# Altium schematic sheet 23005_3.SchDoc: Classic Computer IO Platform
size A3; Date: 06/11/2018; CompanyName: Heber Ltd; Organization: Heber Limited; DocumentNumber: 56-23005; Revision: 3; SheetNumber: 3; SheetTotal: 6
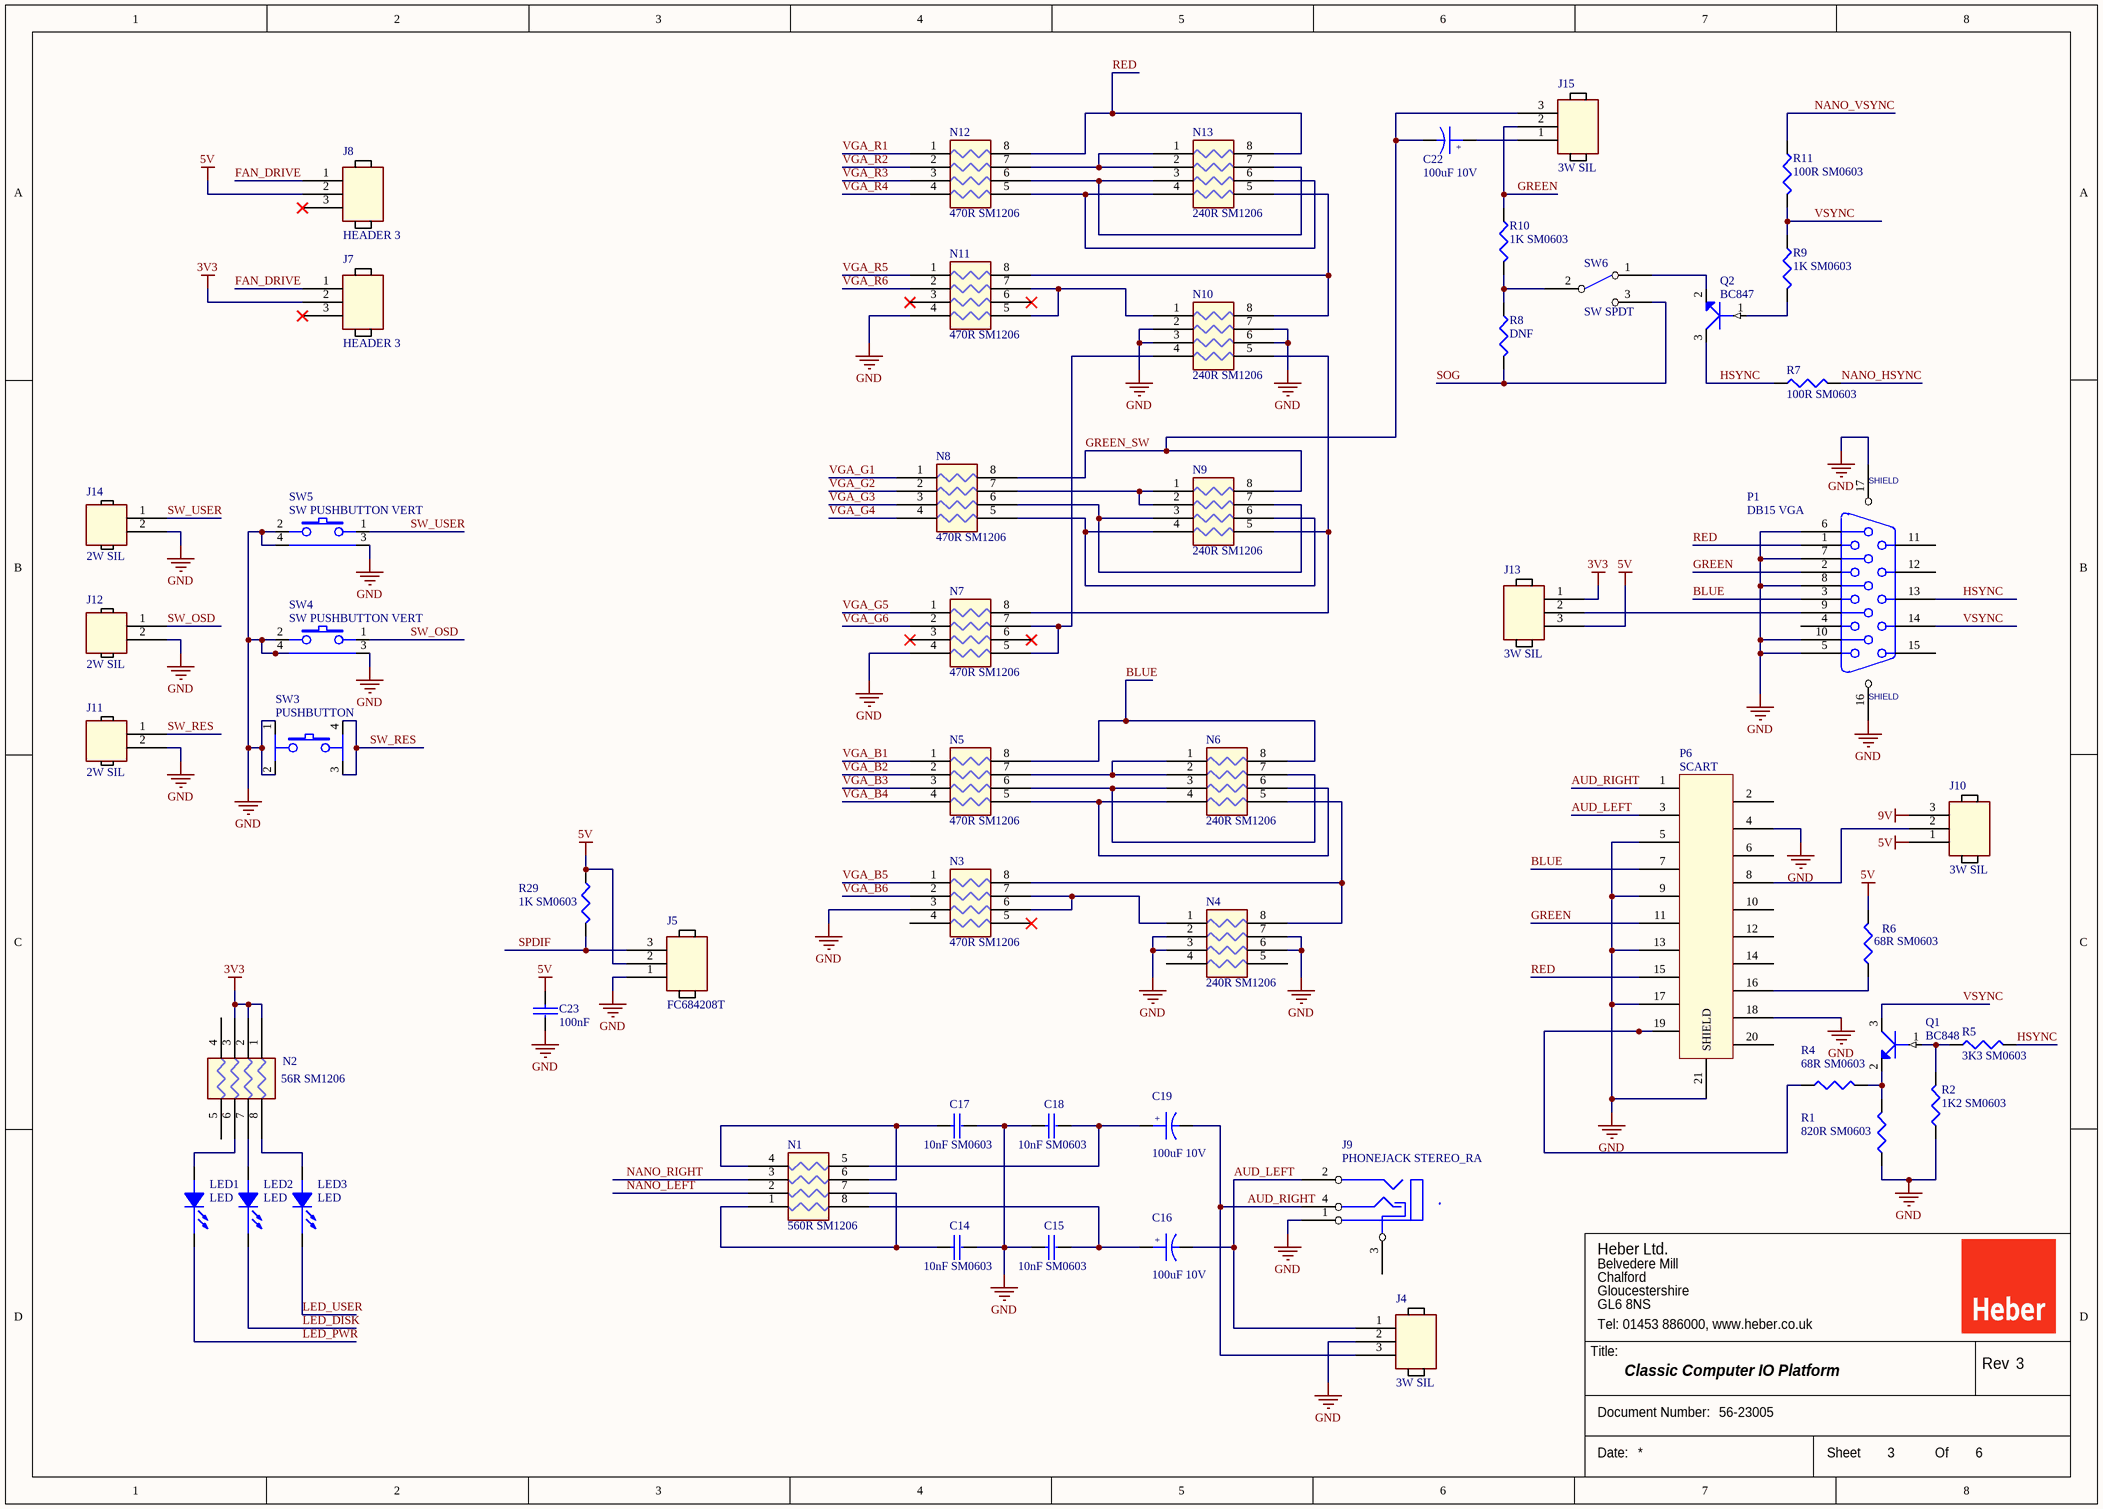
[diagram p0: 23005_3.SchDoc]

## Parts
C14  10nF SM0603  [SM0603]
C15  10nF SM0603  [SM0603]
C16  100uF 10V  [SM1206]
C17  10nF SM0603  [SM0603]
C18  10nF SM0603  [SM0603]
C19  100uF 10V  [SM1206]
C22  100uF 10V  [SM1206]
C23  100nF  [SM0603]
J4  3W SIL  [3WSIL]
J5  FC684208T  [FCR684208T]
J7  HEADER 3  [3W0.1KK]
J8  HEADER 3  [3W0.1KK]
J9  PHONEJACK STEREO_RA  [JACKSOCKET-STEREO]
J10  3W SIL  [3WSIL]
J11  2W SIL  [2WSIL]
J12  2W SIL  [2WSIL]
J13  3W SIL  [3WSIL]
J14  2W SIL  [2WSIL]
J15  3W SIL  [3WSIL]
LED1  LED  [SM0603LED_1]
LED2  LED  [SM0603LED_1]
LED3  LED  [SM0603LED_1]
N1  560R SM1206  [1206RES4_I2]
N2  56R SM1206  [1206RES4_I2]
N3  470R SM1206  [1206RES4_I2]
N4  240R SM1206  [1206RES4_I2]
N5  470R SM1206  [1206RES4_I2]
N6  240R SM1206  [1206RES4_I2]
N7  470R SM1206  [1206RES4_I2]
N8  470R SM1206  [1206RES4_I2]
N9  240R SM1206  [1206RES4_I2]
N10  240R SM1206  [1206RES4_I2]
N11  470R SM1206  [1206RES4_I2]
N12  470R SM1206  [1206RES4_I2]
N13  240R SM1206  [1206RES4_I2]
P1  DB15 VGA  [15WVGASKTRA]
P6  SCART  [K-SCART-024]
Q1  BC848  [SOT23]
Q2  BC847  [SOT23]
R1  820R SM0603  [SM0603]
R2  1K2 SM0603  [SM0603]
R4  68R SM0603  [SM0603]
R5  3K3 SM0603  [SM0603]
R6  68R SM0603  [SM0603]
R7  100R SM0603  [SM0603]
R8  DNF  [SM0603]
R9  1K SM0603  [SM0603]
R10  1K SM0603  [SM0603]
R11  100R SM0603  [SM0603]
R29  1K SM0603  [SM0603]
SW3  PUSHBUTTON  [SW_SM_6MM]
SW4  SW PUSHBUTTON VERT  [SW_TS6H2A]
SW5  SW PUSHBUTTON VERT  [SW_TS6H2A]
SW6  SW SPDT  [SW_ITT_OS102011MS2QN1]

## Nets
3V3: J7.2 J13.1 N2.1 N2.2 N2.3
5V: C23.1 J5.2 J8.2 J10.1 J13.3 R6.2 R29.1
9V: J10.3
GND: C14.2 C15.1 C17.2 C18.1 C23.2 J4.2 J5.1 J9.1 J11.2 J12.2 J14.2 N3.3 N4.2 N4.3 N4.6 N4.7 N7.4 N10.2 N10.3 N10.6 N10.7 N11.4 P1.5 P1.6 P1.7 P1.8 P1.10 P1.16 P1.17 P6.4 P6.5 P6.9 P6.13 P6.17 P6.18 P6.21(SHIELD) R1.2 R2.2 SW3.1 SW3.2 SW4.2 SW4.3 SW4.4 SW5.2 SW5.3 SW5.4
AUD_LEFT: C16.2 J4.1 J9.2 P6.3
AUD_RIGHT: C19.2 J4.3 J9.4 P6.1
BLUE: N5.8 N6.8 P1.3 P6.7
FAN_DRIVE: J7.1 J8.1
GREEN: J15.2 P1.2 P6.11 R10.1
GREEN_SW: C22.2 J15.3 N8.8 N9.8
HSYNC: P1.13 Q2.3(C) R5.1 R7.1
LED_DISK: LED2.2(CATHODE)
LED_PWR: LED1.2(CATHODE)
LED_USER: LED3.2(CATHODE)
NANO_HSYNC: R7.2
NANO_LEFT: N1.2
NANO_RIGHT: N1.3
NANO_VSYNC: R11.1
RED: N12.8 N13.8 P1.1 P6.15
SOG: R8.2 SW6.3(NO)
SPDIF: J5.3 R29.2
SW_OSD: J12.1 SW4.1
SW_RES: J11.1 SW3.3 SW3.4
SW_USER: J14.1 SW5.1
VGA_B1: N5.1
VGA_B2: N5.2
VGA_B3: N5.3
VGA_B4: N5.4
VGA_B5: N3.1
VGA_B6: N3.2
VGA_G1: N8.1
VGA_G2: N8.2
VGA_G3: N8.3
VGA_G4: N8.4
VGA_G5: N7.1
VGA_G6: N7.2
VGA_R1: N12.1
VGA_R2: N12.2
VGA_R3: N12.3
VGA_R4: N12.4
VGA_R5: N11.1
VGA_R6: N11.2
VSYNC: P1.14 Q1.3(C) R9.1 R11.2
NetC14_1: C14.1 N1.1 N1.7
NetC15_2: C15.2 C16.1 N1.8
NetC17_1: C17.1 N1.4 N1.6
NetC18_2: C18.2 C19.1 N1.5
NetC22_1: C22.1 J15.1
NetJ10_2: J10.2 P6.8
NetJ13_2: J13.2 P1.9
NetLED1_1: LED1.1(ANODE) N2.6
NetLED2_1: LED2.1(ANODE) N2.7
NetLED3_1: LED3.1(ANODE) N2.8
NetN3_6: N3.6 N3.7 N4.1
NetN3_8: N3.8 N4.8 N6.5
NetN5_5: N5.5 N6.4 N6.6
NetN5_6: N5.6 N6.3 N6.7
NetN5_7: N5.7 N6.1 N6.2
NetN7_5: N7.5 N7.7 N10.4
NetN7_8: N7.8 N9.5 N10.5
NetN8_5: N8.5 N9.4 N9.6
NetN8_6: N8.6 N9.3 N9.7
NetN8_7: N8.7 N9.1 N9.2
NetN10_1: N10.1 N11.5 N11.7
NetN10_8: N10.8 N11.8 N13.5
NetN12_5: N12.5 N13.4 N13.6
NetN12_6: N12.6 N13.3 N13.7
NetN12_7: N12.7 N13.1 N13.2
NetP6_16: P6.16 R6.1
NetP6_19: P6.19 R4.2
NetQ1_1: Q1.1(B) R2.1 R5.2
NetQ1_2: Q1.2(E) R1.1 R4.1
NetQ2_1: Q2.1(B) R9.2
NetQ2_2: Q2.2(E) SW6.1(NC)
NetR8_1: R8.1 R10.2 SW6.2(COMMON)

Not connected (* = marked no-connect by the designer): J7 3*; J8 3*; J9 3; N2 4 5; N3 4 5*; N4 4 5; N7 3* 6*; N11 3* 6*; P1 4 11 12 15; P6 2(107) 6(111) 10(112) 12(112) 14(112) 20(112)

## Notes on the sheet
- Heber Ltd.
- Belvedere Mill
- Chalford
- GL6 8NS
- Gloucestershire
- Tel: 01453 886000, www.heber.co.uk
- Title:
- Rev
- Document Number:
- Date:
- Sheet
- Of
- (in symbol CAP_POL) +
- (in symbol CONNECTOR DB15 VGA SHIELDED) SHIELD

## Library data of the parts
C14 C15 C17 C18 C23 = C
C16 C19 C22 = CAP_POL
J4 J5 J10 J13 J15 = HEADER 3
J11 J12 J14 = HEADER 2
N1-N13 = RESISTOR DIP 4
P1 = CONNECTOR DB15 VGA SHIELDED
Q1 Q2 = BC846AL_1
R1 R2 R4-R11 R29 = RES
SW3 = SW PUSHBUTTON